# EasyEDA Pro project ProPrj_fpga-expansion-board-v2_2026-01-11.epro

# Schematic Schematic1
Board Name: Board1; Create Date: 2026-01-07; Page Name: SCHEMATIC; Project Name: fpga-expansion-board-v2; Schematic Name: Schematic1; Update Date: 2026-01-11; Company: EasyEDA.com; Page Size: A4; Version: V1.0
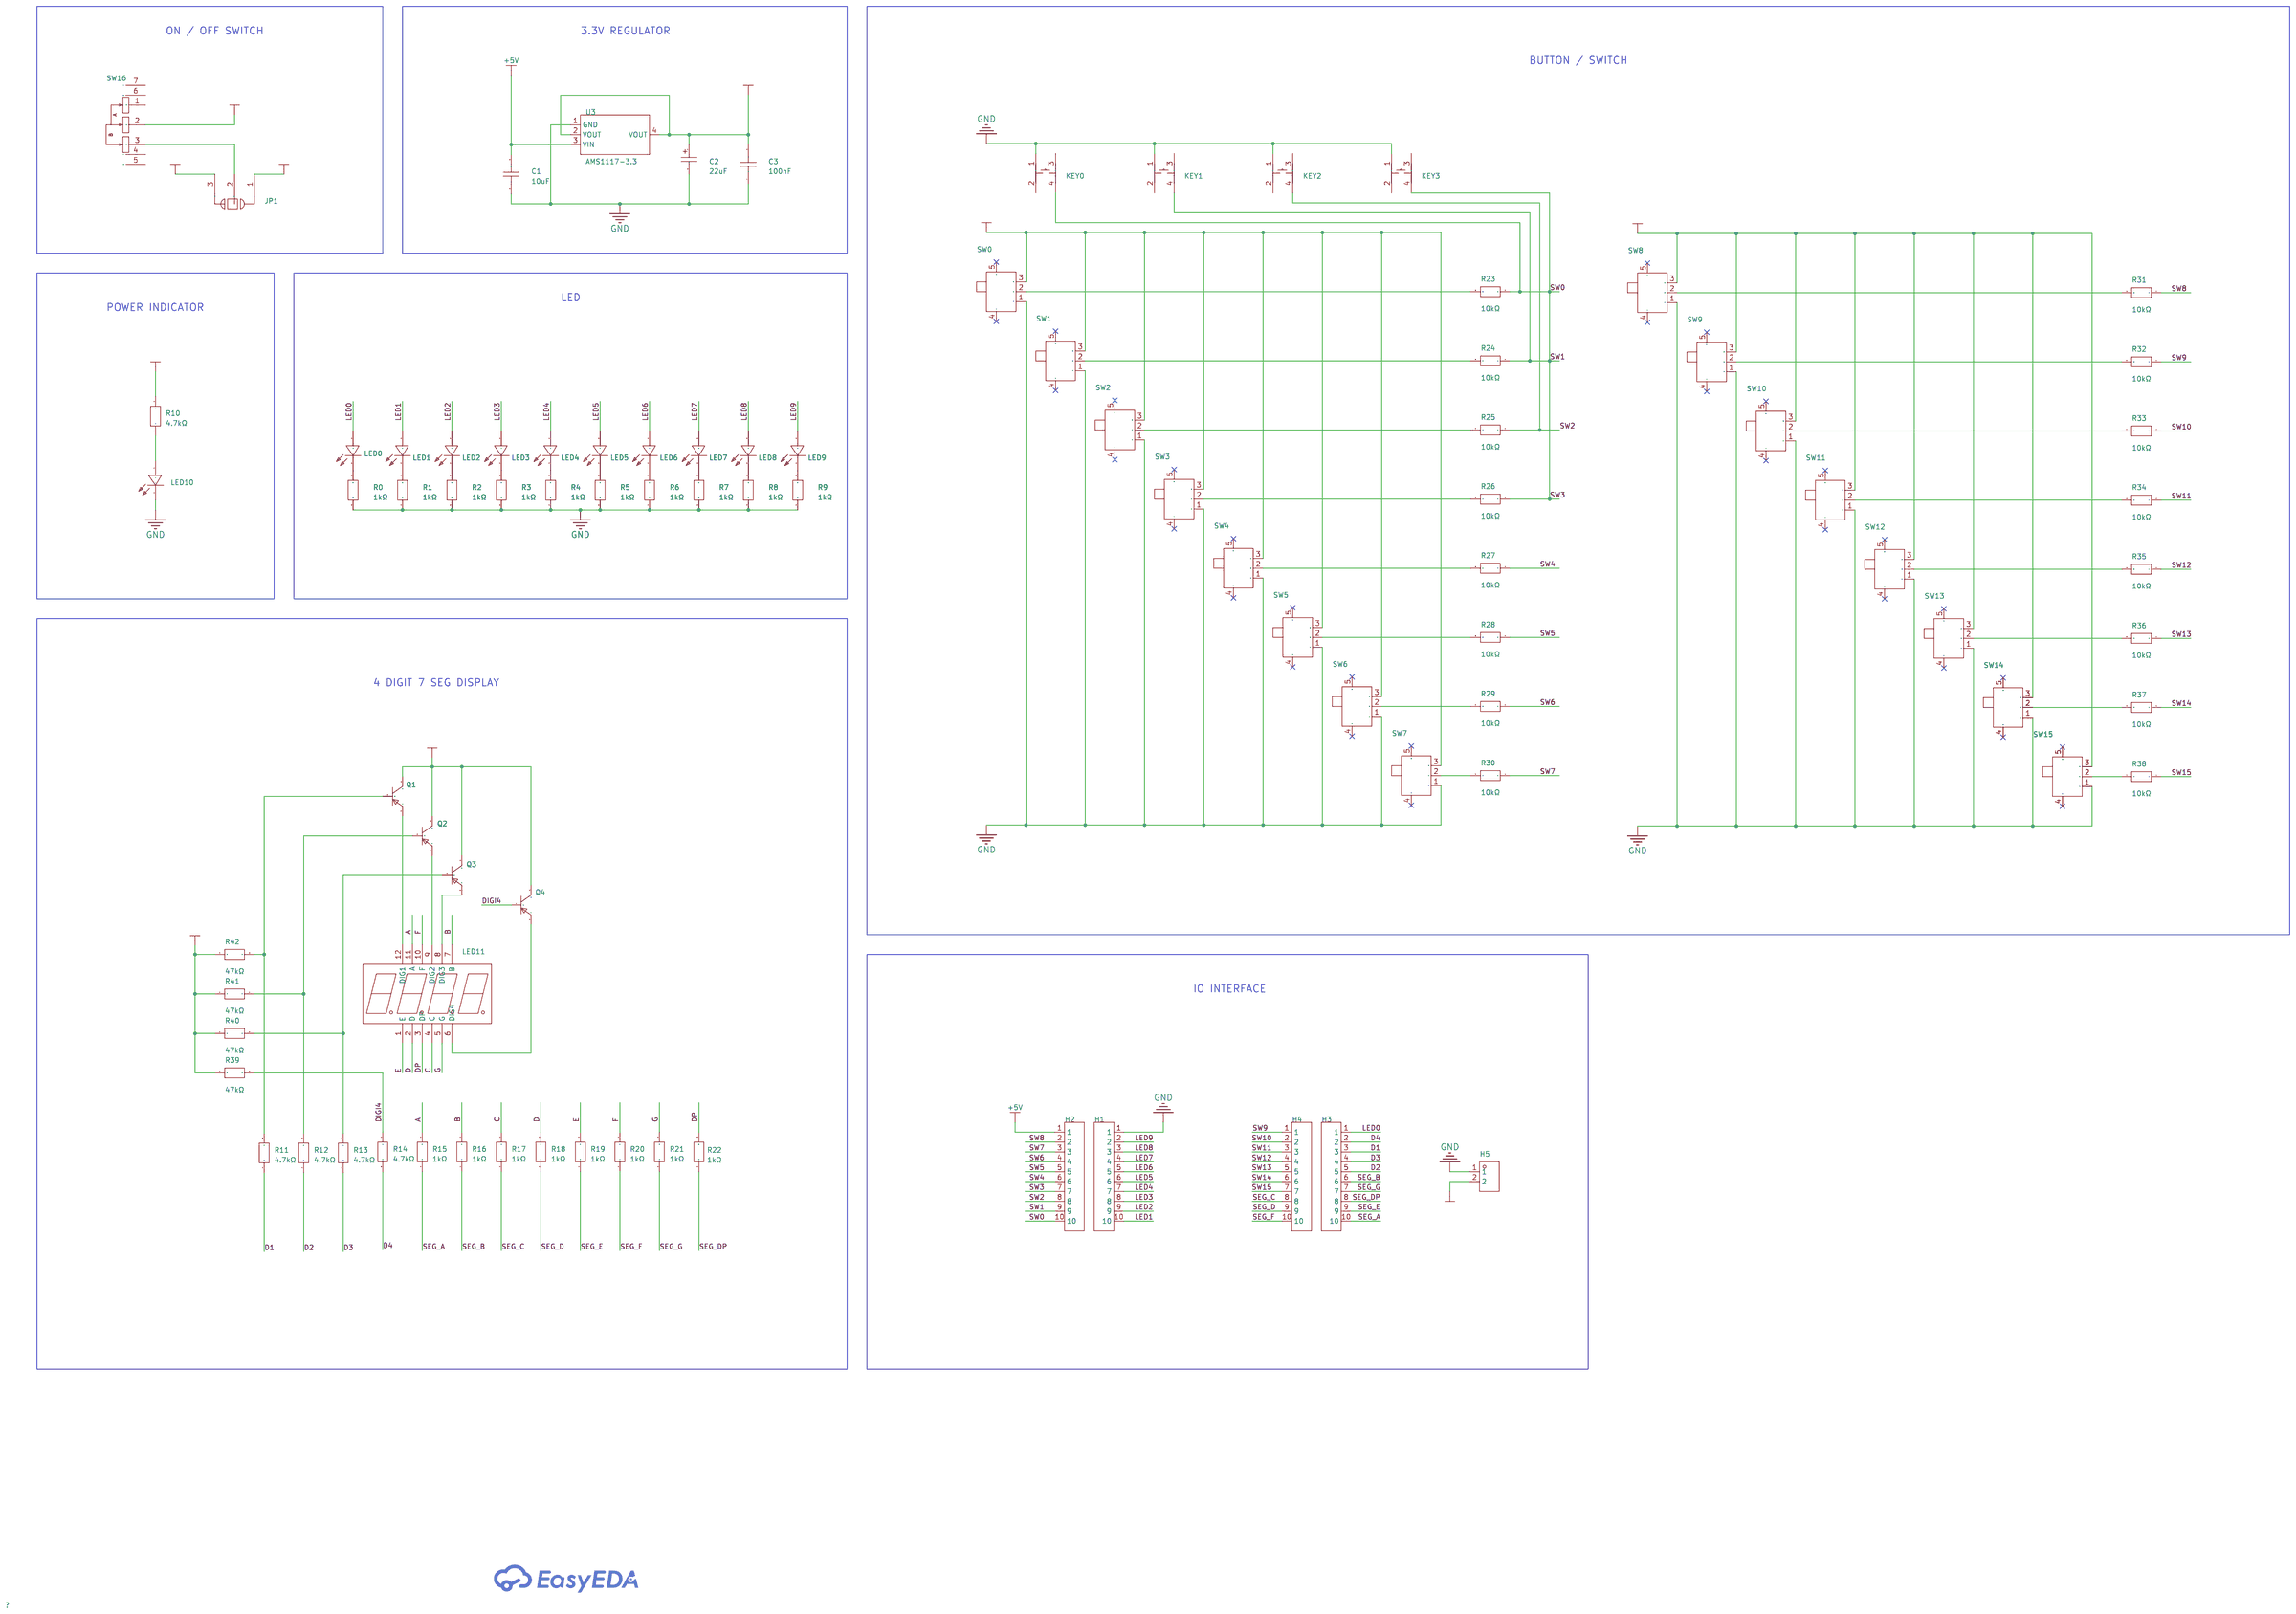
[diagram p0: schematic sheet]

## Parts
C1  10uF  [C0805]
C2  22uF  [CASE-B_3528]
C3  100nF  [C0603]
H1  5AML4-11560-110-W0  [HDR-TH_10P-P2.54-V-M-1]
H2  5AML4-11560-110-W0  [HDR-TH_10P-P2.54-V-M-1]
H3  5AML4-11560-110-W0  [HDR-TH_10P-P2.54-V-M-1]
H4  5AML4-11560-110-W0  [HDR-TH_10P-P2.54-V-M-1]
H5  FG-PZ2.54-01-02P  [HDR-TH_2P-P2.54-V-M]
JP1  Jumper:SolderJumper-3_P1.3mm_Open_RoundedPad1.0x1.5mm  [Jumper:SolderJumper-3_P1.3mm_Open_RoundedPad1.0x1.5mm]
KEY0  KH-6X6X6H-SMT-FS-D  [SW-SMD_4P-L6.0-W6.0-P4.50-LS9.5]
KEY1  KH-6X6X6H-SMT-FS-D  [SW-SMD_4P-L6.0-W6.0-P4.50-LS9.5]
KEY2  KH-6X6X6H-SMT-FS-D  [SW-SMD_4P-L6.0-W6.0-P4.50-LS9.5]
KEY3  KH-6X6X6H-SMT-FS-D  [SW-SMD_4P-L6.0-W6.0-P4.50-LS9.5]
LED0  NCD0805R1  [LED0805-R-RD]
LED1  NCD0805R1  [LED0805-R-RD]
LED2  NCD0805R1  [LED0805-R-RD]
LED3  NCD0805R1  [LED0805-R-RD]
LED4  NCD0805R1  [LED0805-R-RD]
LED5  NCD0805R1  [LED0805-R-RD]
LED6  NCD0805R1  [LED0805-R-RD]
LED7  NCD0805R1  [LED0805-R-RD]
LED8  NCD0805R1  [LED0805-R-RD]
LED9  NCD0805R1  [LED0805-R-RD]
LED10  NCD0805R1  [LED0805-R-RD]
LED11  SR410361N  [LED-SEG-TH_12P-L30.0-W14.0-P2.54-S10.26-BL]
Q1  SS8550  [SOT-23-3_L2.9-W1.4-P1.90-LS2.6-BR]
Q2  SS8550  [SOT-23-3_L2.9-W1.4-P1.90-LS2.6-BR]
Q3  SS8550  [SOT-23-3_L2.9-W1.4-P1.90-LS2.6-BR]
Q4  SS8550  [SOT-23-3_L2.9-W1.4-P1.90-LS2.6-BR]
R0  1kΩ  [R0805]
R1  1kΩ  [R0805]
R2  1kΩ  [R0805]
R3  1kΩ  [R0805]
R4  1kΩ  [R0805]
R5  1kΩ  [R0805]
R6  1kΩ  [R0805]
R7  1kΩ  [R0805]
R8  1kΩ  [R0805]
R9  1kΩ  [R0805]
R10  4.7kΩ  [R0805]
R11  4.7kΩ  [R0805]
R12  4.7kΩ  [R0805]
R13  4.7kΩ  [R0805]
R14  4.7kΩ  [R0805]
R15  1kΩ  [R0805]
R16  1kΩ  [R0805]
R17  1kΩ  [R0805]
R18  1kΩ  [R0805]
R19  1kΩ  [R0805]
R20  1kΩ  [R0805]
R21  1kΩ  [R0805]
R22  1kΩ  [R0805]
R23  10kΩ  [R0805]
R24  10kΩ  [R0805]
R25  10kΩ  [R0805]
R26  10kΩ  [R0805]
R27  10kΩ  [R0805]
R28  10kΩ  [R0805]
R29  10kΩ  [R0805]
R30  10kΩ  [R0805]
R31  10kΩ  [R0805]
R32  10kΩ  [R0805]
R33  10kΩ  [R0805]
R34  10kΩ  [R0805]
R35  10kΩ  [R0805]
R36  10kΩ  [R0805]
R37  10kΩ  [R0805]
R38  10kΩ  [R0805]
R39  47kΩ  [R0805]
R40  47kΩ  [R0805]
R41  47kΩ  [R0805]
R42  47kΩ  [R0805]
SW0  SS12F44G4  [SW-TH_SHOU-HAN_SS12F44G4]
SW1  SS12F44G4  [SW-TH_SHOU-HAN_SS12F44G4]
SW2  SS12F44G4  [SW-TH_SHOU-HAN_SS12F44G4]
SW3  SS12F44G4  [SW-TH_SHOU-HAN_SS12F44G4]
SW4  SS12F44G4  [SW-TH_SHOU-HAN_SS12F44G4]
SW5  SS12F44G4  [SW-TH_SHOU-HAN_SS12F44G4]
SW6  SS12F44G4  [SW-TH_SHOU-HAN_SS12F44G4]
SW7  SS12F44G4  [SW-TH_SHOU-HAN_SS12F44G4]
SW8  SS12F44G4  [SW-TH_SHOU-HAN_SS12F44G4]
SW9  SS12F44G4  [SW-TH_SHOU-HAN_SS12F44G4]
SW10  SS12F44G4  [SW-TH_SHOU-HAN_SS12F44G4]
SW11  SS12F44G4  [SW-TH_SHOU-HAN_SS12F44G4]
SW12  SS12F44G4  [SW-TH_SHOU-HAN_SS12F44G4]
SW13  SS12F44G4  [SW-TH_SHOU-HAN_SS12F44G4]
SW14  SS12F44G4  [SW-TH_SHOU-HAN_SS12F44G4]
SW15  SS12F44G4  [SW-TH_SHOU-HAN_SS12F44G4]
SW16  MK-12C02-G015  [SW-SMD_G-SWITCH_MK-12C02-G015]
U3  AMS1117-3.3  [SOT-223-3_L6.5-W3.4-P2.30-LS7.0-BR]

## Library data of the parts
C1 = GRM21BR61H106KE43L: Capacitance:10uF Tolerance:±10% Tolerance:±10% Voltage Rating:50V Temperature Coefficient:X5R; LCSC Part Name: 10uF ±10% 50V; Supplier Part: C440198; Manufacturer: muRata(村田); Supplier Footprint: 0805; JLCPCB Part Class: Basic Part; Datasheet: https://item.szlcsc.com/datasheet/GRM21BR61H106KE43L/439567.html; Supplier: LCSC; Tolerance: ±10%; Voltage Rating: 50V; Temperature Coefficient: X5R
C2 = TAJB226K016RNJ: Capacitance:22uF Tolerance:±10% Tolerance:±10% Voltage Rating:16V Equivalent Series Resistance(ESR):2.3Ω@100kHz Operating Temperature:-55℃~+125℃ Operating Temperature:-55℃~+125℃; LCSC Part Name: 22uF ±10% 16V; Supplier Part: C8020; Manufacturer: Kyocera AVX; Supplier Footprint: CASE-B-3528-21(mm); JLCPCB Part Class: Extended Part; Supplier: LCSC; Tolerance: ±10%; Voltage Rating: 16V; Equivalent Series Resistance(ESR): 2.3Ω@100kHz; Operating Temperature: -55℃~+125℃
C3 = CC0603KRX7R9BB104: Capacitance:100nF Tolerance:±10% Tolerance:±10% Voltage Rating:50V Temperature Coefficient:X7R; LCSC Part Name: 100nF ±10% 50V; Supplier Part: C14663; Manufacturer: YAGEO(国巨); Supplier Footprint: 0603; JLCPCB Part Class: Basic Part; Datasheet: https://atta.szlcsc.com/upload/public/pdf/source/20180910/C282072_33301C7F631E79921B82A8DAC6BCC5B3.pdf; Supplier: LCSC; Tolerance: ±10%; Voltage Rating: 50V; Temperature Coefficient: X7R
H1-H4 = 5AML4-11560-110-W0: Pin Structure:1x10P Pitch:2.54mm Row Spacing:- Circluar Pins/Square Pins:Pin Header Mounting Type:Through Hole Number of Rows:1 Number of Pins:10P Current Rating:3A Voltage Rating (Max):- Length of Mating Pin:6mm Insulation Height:2.5mm Length of End Conn; LCSC Part Name: 1x10P 间距:2.54mm 方针 直插; Supplier Part: C41374240; Manufacturer: SAMZO(三佐); Supplier Footprint: 插件,P=2.54mm; Datasheet: https://atta.szlcsc.com/upload/public/pdf/source/20240717/E6C59586925ABF058B406B6757A67FC7.pdf; Supplier: LCSC; Pin Structure: 1x10P; Pitch: 2.54mm; Circluar Pins/Square Pins: Pin Header; Mounting Type: Through Hole; Number of Rows: 1; Number of Pins: 10P; Current Rating: 3A; Length of Mating Pin: 6mm; Insulation Height: 2.5mm; Length of End Connection Pin: 3mm; Contact Material: Brass; Contact Plating: Gold; Operating Temperature: -40℃~+105℃; Color: Black
H5 = FG-PZ2.54-01-02P: Pin Structure:1x2P Pitch:2.54mm Circluar Pins/Square Pins:Pin Header Mounting Type:Through Hole Number of Rows:1 Number of Pins:2P Current Rating:3A Length of Mating Pin:6mm Insulation Height:2.5mm Length of End Connection Pin:3mm Contact Plating:Gold Col; LCSC Part Name: 1x2P 间距:2.54mm 方针 直插; Supplier Part: C42391436; Manufacturer: FG(富港); Supplier Footprint: 插件,P=2.54mm; JLCPCB Part Class: Extended Part; Datasheet: https://item.szlcsc.com/datasheet/FG-PZ2.54-01-02P/44326031.html; Supplier: LCSC; Pin Structure: 1x2P; Pitch: 2.54mm; Circluar Pins/Square Pins: Pin Header; Mounting Type: Through Hole; Number of Rows: 1; Number of Pins: 2P; Current Rating: 3A; Length of Mating Pin: 6mm; Insulation Height: 2.5mm; Length of End Connection Pin: 3mm; Contact Plating: Gold; Color: Black
JP1 = Jumper:SolderJumper-3_P1.3mm_Open_RoundedPad1.0x1.5mm
KEY0-KEY3 = KH-6X6X6H-SMT-FS-D: Length:6mm Width:6mm Switch Height:6mm; LCSC Part Name: 轻触开关6*6*6H防水贴片 袋装; Supplier Part: C18186510; Manufacturer: kinghelm(金航标); Supplier Footprint: SMD-4P,6x6mm; JLCPCB Part Class: Extended Part; Datasheet: https://item.szlcsc.com/datasheet/KH-6X6X6H-SMT-FS-D/19335377.html; Supplier: LCSC; Length: 6mm; Width: 6mm; Switch Height: 6mm
LED0-LED10 = NCD0805R1_C84256: Lamp Holder Type:- Emitted Color:Red Forward Voltage (VF):1.6V~2.6V Forward Voltage (VF):1.6V~2.6V Power Dissipation:65mW Forward Current:20mA Dominant Wavelength:615nm~630nm Dominant Wavelength:615nm~630nm Peak Wavelength:- Diode Configuration:独立二极管 Lens; Supplier Part: C84256; Manufacturer: 国星光电; Supplier Footprint: 0805; JLCPCB Part Class: Basic Part; Datasheet: https://atta.szlcsc.com/upload/public/pdf/source/20200820/C84256_F0A75A43B3EAD75808600A0514C76B99.pdf; Supplier: LCSC; Emitted Color: Red; Forward Voltage (VF): 1.6V~2.6V; Power Dissipation: 65mW; Forward Current: 20mA; Dominant Wavelength: 615nm~630nm; Diode Configuration: 独立二极管; Lens Color: 无色透明透镜; Luminous Intensity: 67mcd~195mcd; Viewing Angle: 130°; Operating Temperature: -30℃~+85℃
LED11 = SR410361N: Number of Characters:4Bit Luminous Color:Red LED Polarity:共阳极 Digit/Alpha Size(inch):0.36; LCSC Part Name: 4位0.36英寸红色数码管 共阳极; Supplier Part: C132660; Manufacturer: ARKLED(方舟); Supplier Footprint: 插件; JLCPCB Part Class: Extended Part; Datasheet: https://atta.szlcsc.com/upload/public/pdf/source/20171014/C132660_15079754140001038126.pdf; Supplier: LCSC; Number of Characters: 4Bit; Luminous Color: Red; LED Polarity: 共阳极; Digit/Alpha Size(inch): 0.36
Q1-Q4 = SS8550_C727138: type:PNP Current - Collector(Ic):1.5A Collector - Emitter Voltage VCEO:25V Pd - Power Dissipation:300mW DC Current Gain:200@100mA,1V DC Current Gain:200@100mA,1V Transition frequency(fT):100MHz Current - Collector Cutoff:100nA Vce Saturation(VCE(sat)):500; LCSC Part Name: hfe=120~200 PNP 电流:1.5A 电压:25V; Supplier Part: C727138; Manufacturer: TWGMC(迪嘉); Supplier Footprint: SOT-23; JLCPCB Part Class: Extended Part; Datasheet: https://item.szlcsc.com/datasheet/SS8550/774243.html; Supplier: LCSC; type: PNP; Current - Collector(Ic): 1.5A; Collector - Emitter Voltage VCEO: 25V; Pd - Power Dissipation: 300mW; DC Current Gain: 200@100mA,1V; Transition frequency(fT): 100MHz; Current - Collector Cutoff: 100nA; Vce Saturation(VCE(sat)): 500mV; Operating Temperature: -55℃~+150℃
R0-R9 R15-R22 = 0805W8F1001T5E: Type:Thick Film Resistors Resistance:1kΩ Tolerance:±1% Tolerance:±1% Power(Watts): Overload Voltage (Max): Temperature Coefficient:±100ppm/℃ Temperature Coefficient:±100ppm/℃ Operating Temperature Range:-55℃~+155℃ Operating Temperature Range:-55℃~+155℃; LCSC Part Name: 1kΩ ±1% 125mW 厚膜电阻; Supplier Part: C17513; Manufacturer: UNI-ROYAL(厚声); Supplier Footprint: 0805; JLCPCB Part Class: Basic Part; Datasheet: https://atta.szlcsc.com/upload/public/pdf/source/20200306/C422600_1E6D84923E4A46A82E41ADD87F860B5C.pdf; Supplier: LCSC; Type: Thick Film Resistors; Tolerance: ±1%; Temperature Coefficient: ±100ppm/℃; Operating Temperature Range: -55℃~+155℃
R10-R14 R39-R42 = 0805W8F4701T5E: Type:Thick Film Resistors Resistance:4.7kΩ Tolerance:±1% Tolerance:±1% Power(Watts): Overload Voltage (Max): Temperature Coefficient:±100ppm/℃ Temperature Coefficient:±100ppm/℃ Operating Temperature Range:-55℃~+155℃ Operating Temperature Range:-55℃~+155℃; LCSC Part Name: 4.7kΩ ±1% 125mW 厚膜电阻; Supplier Part: C17673; Manufacturer: UNI-ROYAL(厚声); Supplier Footprint: 0805; JLCPCB Part Class: Basic Part; Datasheet: https://atta.szlcsc.com/upload/public/pdf/source/20200306/C422600_1E6D84923E4A46A82E41ADD87F860B5C.pdf; Supplier: LCSC; Type: Thick Film Resistors; Tolerance: ±1%; Temperature Coefficient: ±100ppm/℃; Operating Temperature Range: -55℃~+155℃
R23-R38 = 0805W8F1002T5E: Type:Thick Film Resistor Resistance:10kΩ Tolerance:±1% Tolerance:±1% Power(Watts):125mW Voltage-Supply(Max):150V Temperature Coefficient:±100ppm/℃ Temperature Coefficient:±100ppm/℃ Operating Temperature:-55℃~+155℃ Operating Temperature:-55℃~+155℃; LCSC Part Name: 10kΩ ±1% 125mW 厚膜电阻; Supplier Part: C17414; Manufacturer: UNI-ROYAL(厚声); Supplier Footprint: 0805; JLCPCB Part Class: Basic Part; Datasheet: https://item.szlcsc.com/datasheet/0805W8F1002T5E/18102.html; Supplier: LCSC; Type: Thick Film Resistor; Tolerance: ±1%; Power(Watts): 125mW; Voltage-Supply(Max): 150V; Temperature Coefficient: ±100ppm/℃; Operating Temperature: -55℃~+155℃
SW0-SW15 = SS12F44G4: Circuit:SPDT Actuator Style:- Termination Style:PC Pin Length:12mm Width:4.5mm Switch Height:6mm Mounting Type:Through Hole Actuator Color:- Current Rating:300mA Voltage Rating:50V Life:5,000 cycles Operating Temperature:-10℃~+50℃ Operating Temperature:-1; Supplier Part: C2887261; Manufacturer: SHOU HAN(首韩); Supplier Footprint: 插件,12x4.5mm; JLCPCB Part Class: Extended Part; Datasheet: https://item.szlcsc.com/datasheet/SS12F44G4/3103829.html; Supplier: LCSC; Circuit: SPDT; Termination Style: PC Pin; Length: 12mm; Width: 4.5mm; Switch Height: 6mm; Mounting Type: Through Hole; Current Rating: 300mA; Voltage Rating: 50V; Life: 5,000 cycles; Operating Temperature: -10℃~+50℃
SW16 = MK-12C02-G015_C2911519: Circuit:SPDT Actuator Style:Rectangular Columnar Termination Style:- Length:6.6mm Width:1.4mm Switch Height:4.2mm Mounting Type:Surface Mount, Right Angle Actuator Color:Black Current Rating:1A Voltage Rating:6V Life:10,000 Cycles Operating Temperature:-2; LCSC Part Name: 七脚贴片微型拨动开关 G1.5; Supplier Part: C2911519; Manufacturer: G-Switch(品赞); Supplier Footprint: SMD,6.6x1.4mm; JLCPCB Part Class: Extended Part; Datasheet: https://item.szlcsc.com/datasheet/MK-12C02-G015/3191561.html; Supplier: LCSC; Circuit: SPDT; Actuator Style: Rectangular Columnar; Length: 6.6mm; Width: 1.4mm; Switch Height: 4.2mm; Mounting Type: Surface Mount, Right Angle; Actuator Color: Black; Current Rating: 1A; Voltage Rating: 6V; Life: 10,000 Cycles; Operating Temperature: -20℃~+70℃
U3 = AMS1117-3.3_C6186: Output Type:Fixed Voltage - Supply:16V Output Voltage:3.3V Output Voltage:3.3V Output Current:1A Power Supply Rejection Ratio (PSRR):72dB@(120Hz) Voltage Dropout:1.1V@(800mA) standby current:5mA Noise:0.003%Vout Features:Over Current Protection；Over Tempe; LCSC Part Name: 输出3.3V 1A; Supplier Part: C6186; Manufacturer: AMS; Supplier Footprint: SOT-223; JLCPCB Part Class: Basic Part; Datasheet: https://item.szlcsc.com/datasheet/AMS1117-3.3/6652.html; Supplier: LCSC; Output Type: Fixed; Voltage - Supply: 16V; Output Voltage: 3.3V; Output Current: 1A; Power Supply Rejection Ratio (PSRR): 72dB@(120Hz); Voltage Dropout: 1.1V@(800mA); standby current: 5mA; Noise: 0.003%Vout; Features: Over Current Protection；Over Temperature Protection; Operating Temperature: -40℃~+125℃; Output Configuration: Positive; Number of Outputs: 1

## Nets
3.3V: Q1.3(C) Q2.3(C) Q3.3(C) Q4.3(C) R39.1 R40.1 R41.1 R42.1 SW0.3 SW1.3 SW2.3 SW3.3 SW4.3 SW5.3 SW6.3 SW7.3 SW8.3 SW9.3 SW10.3 SW11.3 SW12.3 SW13.3 SW14.3 SW15.3 SW16.2
3.3V_F: H5.2 JP1.1
3.3V_R: C2.1 C3.2 JP1.3 R10.2 U3.2(VOUT) U3.4(VOUT)
+5V: C1.2 H2.1 U3.3(VIN)
GND: C1.1 C2.2 C3.1 H1.1 H5.1 KEY0.1(A) KEY1.1(A) KEY2.1(A) KEY3.1(A) LED10.2(-) R0.1 R1.1 R2.1 R3.1 R4.1 R5.1 R6.1 R7.1 R8.1 R9.1 SW0.1 SW1.1 SW2.1 SW3.1 SW4.1 SW5.1 SW6.1 SW7.1 SW8.1 SW9.1 SW10.1 SW11.1 SW12.1 SW13.1 SW14.1 SW15.1 U3.1(GND)
A: LED11.11(A) R15.2
B: LED11.7(B) R16.2
C: LED11.4(C) R17.2
D: LED11.2(D) R18.2
D1: H3.3 R11.1
D2: H3.5 R12.1
D3: H3.4 R13.2
D4: H3.2 R14.2
DIGI4: Q4.1(B) R14.1 R39.2
DP: LED11.3(DP) R22.2
E: LED11.1(E) R19.2
F: LED11.10(F) R20.2
G: LED11.5(G) R21.2
LED0: H3.1 LED0.1(+)
LED1: H1.10 LED1.1(+)
LED2: H1.9 LED2.1(+)
LED3: H1.8 LED3.1(+)
LED4: H1.7 LED4.1(+)
LED5: H1.6 LED5.1(+)
LED6: H1.5 LED6.1(+)
LED7: H1.4 LED7.1(+)
LED8: H1.3 LED8.1(+)
LED9: H1.2 LED9.1(+)
SEG_A: H3.10 R15.1
SEG_B: H3.6 R16.1
SEG_C: H4.8 R17.1
SEG_D: H4.9 R18.1
SEG_DP: H3.8 R22.1
SEG_E: H3.9 R19.1
SEG_F: H4.10 R20.1
SEG_G: H3.7 R21.1
SW0: H2.10 KEY0.4(D) R23.1
SW1: H2.9 KEY1.4(D) R24.1
SW2: H2.8 KEY2.4(D) R25.1
SW3: H2.7 KEY3.4(D) R26.1
SW4: H2.6 R27.1
SW5: H2.5 R28.1
SW6: H2.4 R29.1
SW7: H2.3 R30.1
SW8: H2.2 R31.1
SW9: H4.1 R32.1
SW10: H4.2 R33.1
SW11: H4.3 R34.1
SW12: H4.4 R35.1
SW13: H4.5 R36.1
SW14: H4.6 R37.1
SW15: H4.7 R38.1
$2N1941: LED10.1(+) R10.1
$2N2644: LED11.6(DIG4) Q4.2(E)
$2N2657: Q1.1(B) R11.2 R42.2
$2N2658: Q2.1(B) R12.2 R41.2
$2N2659: Q3.1(B) R13.1 R40.2
$2N2685: LED11.8(DIG3) Q3.2(E)
$2N2688: LED11.9(DIG2) Q2.2(E)
$2N2689: LED11.12(DIG1) Q1.2(E)
$2N3631: LED0.2(-) R0.2
$2N3633: LED1.2(-) R1.2
$2N3635: LED2.2(-) R2.2
$2N3638: LED4.2(-) R4.2
$2N3640: LED3.2(-) R3.2
$2N3642: LED5.2(-) R5.2
$2N3644: LED6.2(-) R6.2
$2N3646: LED7.2(-) R7.2
$2N3648: LED8.2(-) R8.2
$2N3652: LED9.2(-) R9.2
$2N6552: JP1.2 SW16.3
$2N13851: R30.2 SW7.2
$2N13869: R29.2 SW6.2
$2N13870: R28.2 SW5.2
$2N13871: R27.2 SW4.2
$2N13872: R26.2 SW3.2
$2N13873: R25.2 SW2.2
$2N13874: R24.2 SW1.2
$2N13876: R38.2 SW15.2
$2N13894: R37.2 SW14.2
$2N13895: R36.2 SW13.2
$2N13896: R35.2 SW12.2
$2N13897: R34.2 SW11.2
$2N13898: R33.2 SW10.2
$2N13899: R32.2 SW9.2
$2N13900: R31.2 SW8.2
$2N13901: R23.2 SW0.2

Not connected (* = marked no-connect by the designer): KEY0 2(B) 3(C); KEY1 2(B) 3(C); KEY2 2(B) 3(C); KEY3 2(B) 3(C); SW0 4* 5*; SW1 4* 5*; SW2 4* 5*; SW3 4* 5*; SW4 4* 5*; SW5 4* 5*; SW6 4* 5*; SW7 4* 5*; SW8 4* 5*; SW9 4* 5*; SW10 4* 5*; SW11 4* 5*; SW12 4* 5*; SW13 4* 5*; SW14 4* 5*; SW15 4* 5*; SW16 1 4 5 6 7

## Notes on the sheet
- ON / OFF SWITCH
- 3.3V REGULATOR
- BUTTON / SWITCH
- LED
- POWER INDICATOR
- 4 DIGIT 7 SEG DISPLAY
- IO INTERFACE

# Board PCB1
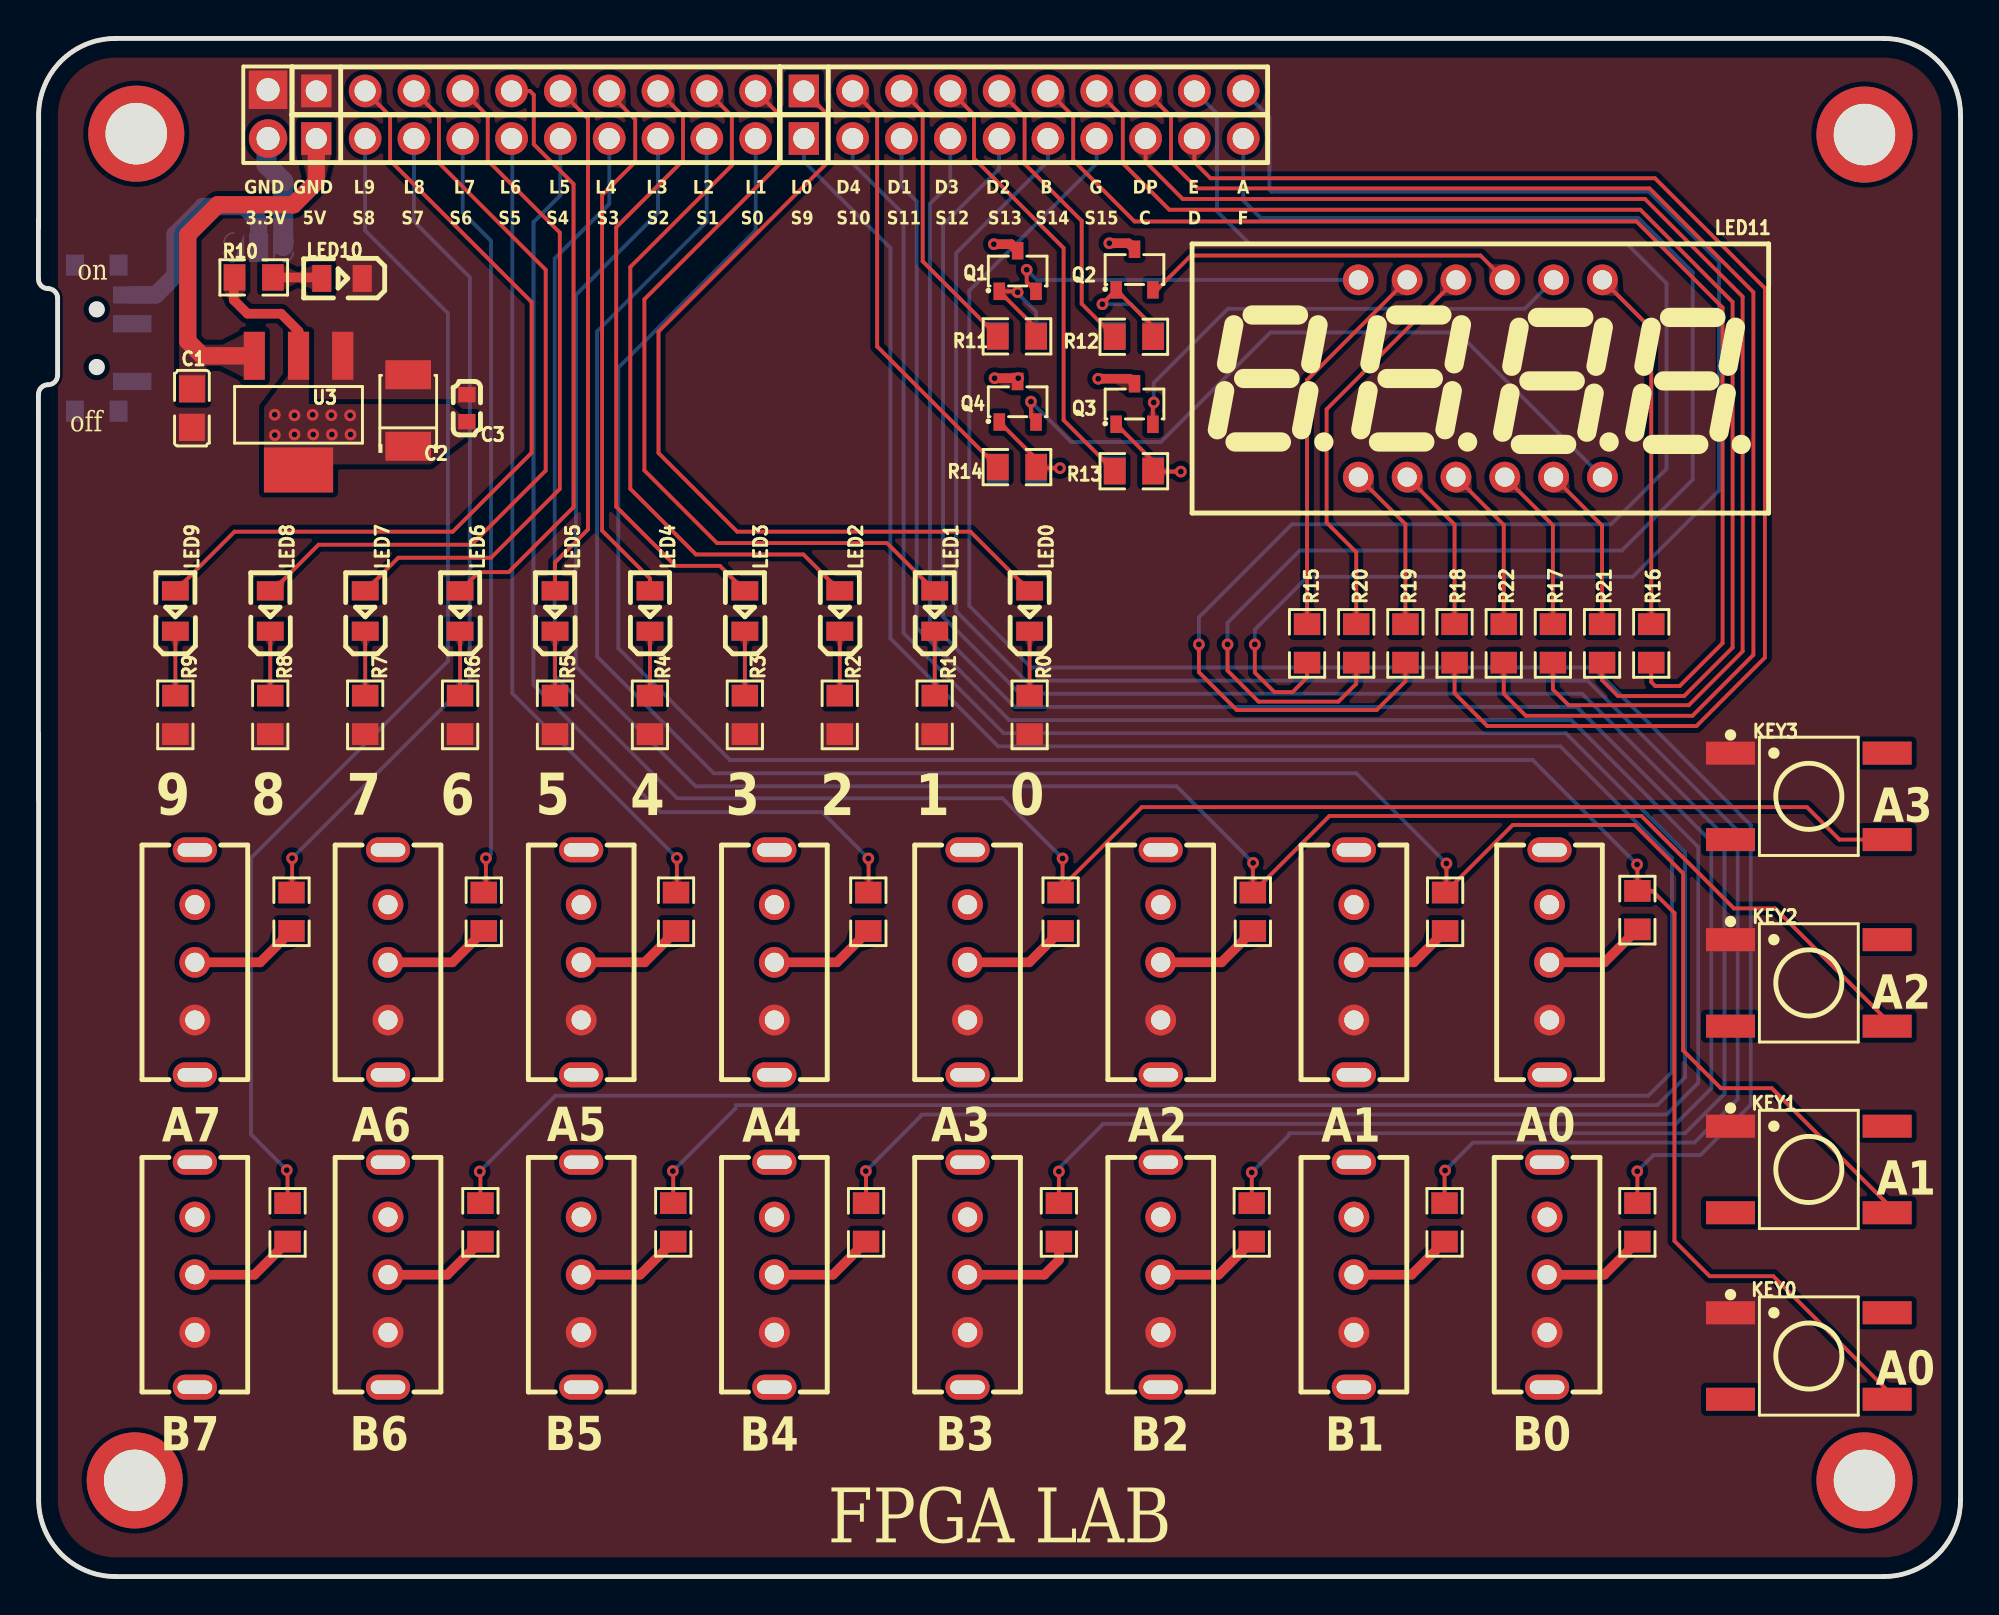
[diagram p1: board, top side]
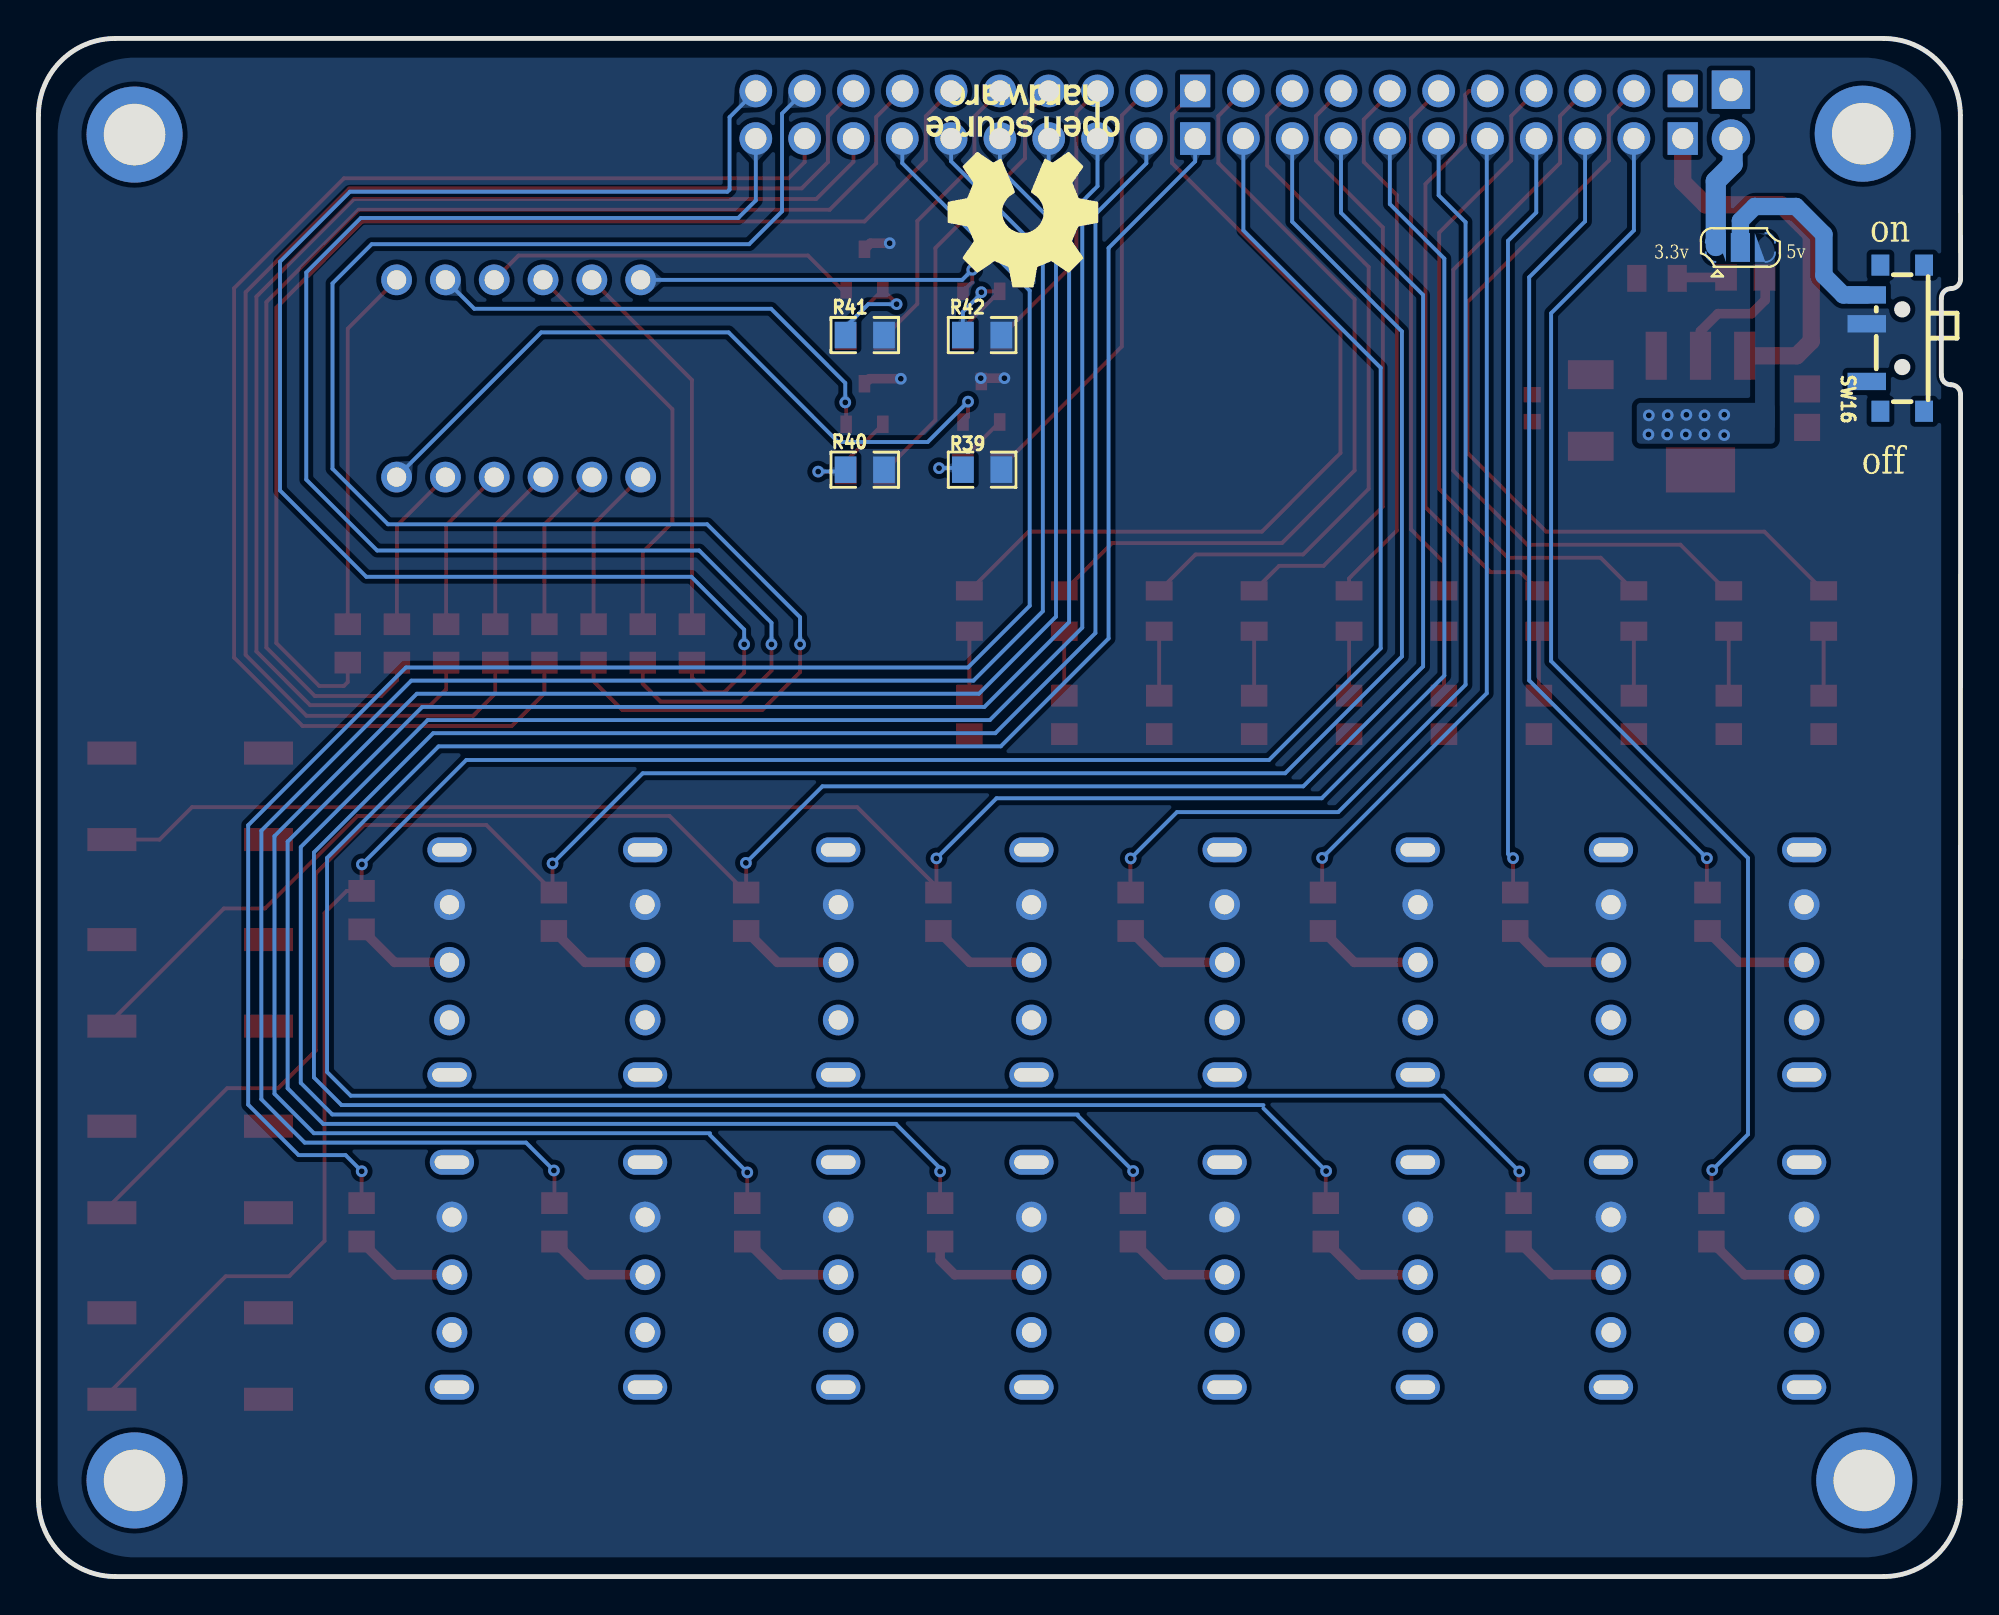
[diagram p2: board, bottom side, seen from below]

Outline 100.01 x 80 mm; copper layers: Top Layer, Bottom Layer. Coordinates in mm from the lower left corner of the outline.
Outline path: 0,67.49 0.01,76 arc(1.18,78.83) 4.01,80 96.01,80 arc(98.84,78.83) 100.01,76 100.01,4 arc(98.84,1.17) 96.01,0 4.01,0 arc(1.18,1.17) 0.01,4 0,61.49 arc(0.15,61.84) 0.5,61.99 arc(0.85,62.14) 1,62.49 1,66.49 arc(0.85,66.84) 0.5,66.99 arc(0.15,67.14) 0,67.49
Stack: Top Layer 0.035mm / Dielectric1 1.51mm FR4 er 4.5 / Bottom Layer 0.035mm

## Design rules (mm)
template: Custom Config
spacing copperThickness1oz (default): track to track 0.102, other pairs 0.152 to 0.3
spacing copperThickness2oz: track to track 0.203, other pairs 0.152 to 0.3
track width copperThickness1oz (default): min 0.2, default 0.5, max 2.54
track width copperThickness2oz: min 0.203, default 0.254, max 2.54
differential pair differentialPair (default): width min 0.127, default 0.254, max 2.54; gap min 0.152, default 0.152
via viaSize (default): diameter min 0.5, default 0.61, max 10; hole min 0.3, default 0.305, max 6.3

## Placement (name value [footprint] x y rotation side)
C1  10uF  [C0805]  7.99 60.77 90 top
C2  22uF  [CASE-B_3528]  19.24 60.65 90 top
C3  100nF  [C0603]  22.29 60.77 270 top
H1  5AML4-11560-110-W0  [HDR-TH_10P-P2.54-V-M-1]  25.89 77.27 0 top
H2  5AML4-11560-110-W0  [HDR-TH_10P-P2.54-V-M-1]  25.89 74.79 0 top
H3  5AML4-11560-110-W0  [HDR-TH_10P-P2.54-V-M-1]  51.25 77.27 0 top
H4  5AML4-11560-110-W0  [HDR-TH_10P-P2.54-V-M-1]  51.25 74.79 0 top
H5  FG-PZ2.54-01-02P  [HDR-TH_2P-P2.54-V-M]  11.95 76.06 270 top
JP1  -  [Jumper:SolderJumper-3_P1.3mm_Open_RoundedPad1.0x1.5mm]  11.45 69.13 180 bottom
KEY0  KH-6X6X6H-SMT-FS-D  [SW-SMD_4P-L6.0-W6.0-P4.50-LS9.5]  92.11 11.47 0 top
KEY1  KH-6X6X6H-SMT-FS-D  [SW-SMD_4P-L6.0-W6.0-P4.50-LS9.5]  92.11 21.17 0 top
KEY2  KH-6X6X6H-SMT-FS-D  [SW-SMD_4P-L6.0-W6.0-P4.50-LS9.5]  92.11 30.88 0 top
KEY3  KH-6X6X6H-SMT-FS-D  [SW-SMD_4P-L6.0-W6.0-P4.50-LS9.5]  92.11 40.58 0 top
LED0  NCD0805R1  [LED0805-R-RD]  51.57 50.22 90 top
LED1  NCD0805R1  [LED0805-R-RD]  46.63 50.22 90 top
LED2  NCD0805R1  [LED0805-R-RD]  41.7 50.22 90 top
LED3  NCD0805R1  [LED0805-R-RD]  36.76 50.22 90 top
LED4  NCD0805R1  [LED0805-R-RD]  31.82 50.22 90 top
LED5  NCD0805R1  [LED0805-R-RD]  26.88 50.22 90 top
LED6  NCD0805R1  [LED0805-R-RD]  21.94 50.22 90 top
LED7  NCD0805R1  [LED0805-R-RD]  17 50.22 90 top
LED8  NCD0805R1  [LED0805-R-RD]  12.06 50.22 90 top
LED9  NCD0805R1  [LED0805-R-RD]  7.12 50.22 90 top
LED10  NCD0805R1  [LED0805-R-RD]  15.79 67.52 180 top
LED11  SR410361N  [LED-SEG-TH_12P-L30.0-W14.0-P2.54-S10.26-BL]  75.02 62.31 0 top
NOREF  -  [Pad_e133]  95.01 5 0 top
NOREF#2  -  [Pad_e132]  95.01 75 0 top
NOREF#3  -  [Pad_e134]  5.01 5 0 top
NOREF#4  -  [Pad_e130]  5.09 75.05 0 top
Q1  SS8550  [SOT-23-3_L2.9-W1.4-P1.90-LS2.6-BR]  50.95 67.9 270 top
Q2  SS8550  [SOT-23-3_L2.9-W1.4-P1.90-LS2.6-BR]  57.03 67.98 270 top
Q3  SS8550  [SOT-23-3_L2.9-W1.4-P1.90-LS2.6-BR]  57.03 60.99 270 top
Q4  SS8550  [SOT-23-3_L2.9-W1.4-P1.90-LS2.6-BR]  50.95 61.1 270 top
R0  1kΩ  [R0805]  51.57 44.82 90 top
R1  1kΩ  [R0805]  46.63 44.82 90 top
R2  1kΩ  [R0805]  41.69 44.82 90 top
R3  1kΩ  [R0805]  36.76 44.82 90 top
R4  1kΩ  [R0805]  31.82 44.82 90 top
R5  1kΩ  [R0805]  26.88 44.82 90 top
R6  1kΩ  [R0805]  21.94 44.82 90 top
R7  1kΩ  [R0805]  17 44.82 90 top
R8  1kΩ  [R0805]  12.06 44.82 90 top
R9  1kΩ  [R0805]  7.12 44.82 90 top
R10  4.7kΩ  [R0805]  11.2 67.57 180 top
R11  4.7kΩ  [R0805]  50.91 64.5 0 top
R12  4.7kΩ  [R0805]  57 64.48 0 top
R13  4.7kΩ  [R0805]  57 57.49 180 top
R14  4.7kΩ  [R0805]  50.91 57.7 180 top
R15  1kΩ  [R0805]  66.01 48.53 90 top
R16  1kΩ  [R0805]  83.92 48.53 90 top
R17  1kΩ  [R0805]  78.8 48.53 90 top
R18  1kΩ  [R0805]  73.68 48.53 90 top
R19  1kΩ  [R0805]  71.12 48.53 90 top
R20  1kΩ  [R0805]  68.57 48.53 90 top
R21  1kΩ  [R0805]  81.36 48.53 90 top
R22  1kΩ  [R0805]  76.24 48.53 90 top
R23  10kΩ  [R0805]  83.2 34.66 270 top
R24  10kΩ  [R0805]  73.19 34.58 270 top
R25  10kΩ  [R0805]  63.19 34.58 270 top
R26  10kΩ  [R0805]  53.18 34.58 270 top
R27  10kΩ  [R0805]  43.18 34.58 270 top
R28  10kΩ  [R0805]  33.17 34.58 270 top
R29  10kΩ  [R0805]  23.17 34.58 270 top
R30  10kΩ  [R0805]  13.17 34.58 270 top
R31  10kΩ  [R0805]  12.96 18.42 270 top
R32  10kΩ  [R0805]  23 18.42 270 top
R33  10kΩ  [R0805]  33.03 18.42 270 top
R34  10kΩ  [R0805]  43.06 18.42 270 top
R35  10kΩ  [R0805]  53.1 18.42 270 top
R36  10kΩ  [R0805]  63.13 18.42 270 top
R37  10kΩ  [R0805]  73.16 18.42 270 top
R38  10kΩ  [R0805]  83.2 18.42 270 top
R39  47kΩ  [R0805]  50.91 57.57 0 bottom
R40  47kΩ  [R0805]  57.02 57.57 0 bottom
R41  47kΩ  [R0805]  57.02 64.58 0 bottom
R42  47kΩ  [R0805]  50.91 64.58 0 bottom
SW0  SS12F44G4  [SW-TH_SHOU-HAN_SS12F44G4]  78.62 31.95 90 top
SW1  SS12F44G4  [SW-TH_SHOU-HAN_SS12F44G4]  68.45 31.95 90 top
SW2  SS12F44G4  [SW-TH_SHOU-HAN_SS12F44G4]  58.39 31.95 90 top
SW3  SS12F44G4  [SW-TH_SHOU-HAN_SS12F44G4]  48.34 31.95 90 top
SW4  SS12F44G4  [SW-TH_SHOU-HAN_SS12F44G4]  38.29 31.95 90 top
SW5  SS12F44G4  [SW-TH_SHOU-HAN_SS12F44G4]  28.24 31.95 90 top
SW6  SS12F44G4  [SW-TH_SHOU-HAN_SS12F44G4]  18.19 31.95 90 top
SW7  SS12F44G4  [SW-TH_SHOU-HAN_SS12F44G4]  8.14 31.95 90 top
SW8  SS12F44G4  [SW-TH_SHOU-HAN_SS12F44G4]  8.14 15.7 90 top
SW9  SS12F44G4  [SW-TH_SHOU-HAN_SS12F44G4]  18.19 15.7 90 top
SW10  SS12F44G4  [SW-TH_SHOU-HAN_SS12F44G4]  28.24 15.7 90 top
SW11  SS12F44G4  [SW-TH_SHOU-HAN_SS12F44G4]  38.29 15.7 90 top
SW12  SS12F44G4  [SW-TH_SHOU-HAN_SS12F44G4]  48.34 15.7 90 top
SW13  SS12F44G4  [SW-TH_SHOU-HAN_SS12F44G4]  58.39 15.7 90 top
SW14  SS12F44G4  [SW-TH_SHOU-HAN_SS12F44G4]  68.45 15.7 90 top
SW15  SS12F44G4  [SW-TH_SHOU-HAN_SS12F44G4]  78.5 15.7 90 top
SW16  MK-12C02-G015  [SW-SMD_G-SWITCH_MK-12C02-G015]  3.39 64.41 90 bottom
U3  AMS1117-3.3  [SOT-223-3_L6.5-W3.4-P2.30-LS7.0-BR]  13.53 60.52 90 top

## Footprints (pads in the part's own frame, mm; a bottom-side part is the same pattern mirrored in y, then rotated)
C0603
  rect 0.8x0.9 smd: 1(-0.7,0) 2(0.7,0)
C0805
  rect 1.41x1.35 smd: 1(-1,0) 2(1,0)
CASE-B_3528
  rect 1.506x2.376 smd: 1(-1.861,0) 2(1.861,0)
HDR-TH_2P-P2.54-V-M
  rect 2x2 hole 1.2: 1(-1.27,0)
  round 2 hole 1.2: 2(1.27,0)
HDR-TH_10P-P2.54-V-M-1
  rect 1.575x1.7 hole 1.1: 1(-11.43,0)
  round 1.7 hole 1.1: 2(-8.89,0) 3(-6.35,0) 4(-3.81,0) 5(-1.27,0) 6(1.27,0) 7(3.81,0) 8(6.35,0) 9(8.89,0) 10(11.43,0)
Jumper:SolderJumper-3_P1.3mm_Open_RoundedPad1.0x1.5mm
  custom 1.05x1.5 smd: 1(-1.3,0) 3(1.3,0)
  rect 1x1.5 smd: 2(0,0)
LED0805-R-RD
  rect 1x1.399 smd: 1(1.05,0) 2(-1.05,0)
LED-SEG-TH_12P-L30.0-W14.0-P2.54-S10.26-BL
  round 1.6 hole 1: 1(-6.35,-5.13) 2(-3.81,-5.13) 3(-1.27,-5.13) 4(1.27,-5.13) 5(3.81,-5.13) 6(6.35,-5.13) 7(6.35,5.13) 8(3.81,5.13) 9(1.27,5.13) 10(-1.27,5.13) 11(-3.81,5.13) 12(-6.35,5.13)
Pad_e130
  round 5 hole 3.2: 1(0,0)
Pad_e132
  round 5 hole 3.2: 1(0,0)
Pad_e133
  round 5 hole 3.2: 2(0,0)
Pad_e134
  round 5 hole 3.2: 3(0,0)
R0805
  rect 1.133x1.377 smd: 1(-1,0) 2(1,0)
SOT-23-3_L2.9-W1.4-P1.90-LS2.6-BR
  rect 0.91x0.6 smd: 1(1.055,-0.955) 2(1.055,0.955) 3(-1.055,0)
SOT-223-3_L6.5-W3.4-P2.30-LS7.0-BR
  rect 2.5x1.1 smd: 1(2.97,-2.3) 2(2.97,0) 3(2.97,2.3)
  rect 2.34x3.6 smd: 4(-2.97,0)
SW-SMD_4P-L6.0-W6.0-P4.50-LS9.5
  rect 2.55x1.2 smd: 1(-4.075,2.25) 2(4.075,2.25) 3(-4.075,-2.25) 4(4.075,-2.25)
SW-SMD_G-SWITCH_MK-12C02-G015
  rect 0.9x2 smd: 1(-2.25,1.49) 2(0.75,1.49) 3(2.25,1.49)
  rect 1.1x0.93 smd: 4(3.8,0.779) 5(3.8,-1.49) 6(-3.8,-1.49) 7(-3.8,0.779)
SW-TH_SHOU-HAN_SS12F44G4
  round 1.6 hole 1: 1(-3,0) 2(0,0) 3(3,0)
  oval 1.3x2.3 hole 0.7x1.8: 4(5.85,0) 5(-5.85,0)

## Nets
As in the schematic.

Pads without a net: KEY0 2 3; KEY1 2 3; KEY2 2 3; KEY3 2 3; NOREF 2; NOREF#2 1; NOREF#3 3; NOREF#4 1; SW0 4 5; SW1 4 5; SW2 4 5; SW3 4 5; SW4 4 5; SW5 4 5; SW6 4 5; SW7 4 5; SW8 4 5; SW9 4 5; SW10 4 5; SW11 4 5; SW12 4 5; SW13 4 5; SW14 4 5; SW15 4 5; SW16 1 4 5 6 7

## Via types
v1: diameter 0.61, hole 0.305, Top Layer to Bottom Layer, 41 vias

## Routing (per net, layer and track width the routed paths; a pad name or vN(x,y) marks a point on that pad's centre or on a via; arc(x,y) is an arc through that point)
3.3V: length 6
  Top Layer w0.5: v1(55.72,69.35) 56.72,69.35 Q2.3 ; Q3.3 56.77,62.3 v1(55.14,62.3) ; Q1.3 50.61,69.3 v1(49.71,69.3) ; v1(50.98,62.33) v1(49.75,62.33)
3.3V_F: length 5.8
  Bottom Layer w1.05: 12.74,69.2 12.74,72.57 11.86,73.45 11.86,74.38 12,74.52 12,74.55 11.97,74.57
3.3V_R: length 6.1
  Top Layer w0.5: 13.59,63.93 13.54,63.98 13.54,64.77 12.62,65.69 10.87,65.69 10.17,66.39 10.17,67.47 10.27,67.57
  vias: v1(12.3,60.43) v1(12.3,59.37) v1(13.32,60.4) v1(13.32,59.4) v1(14.27,60.42) v1(14.3,59.4) v1(15.24,60.4) v1(15.27,59.4) v1(16.22,60.39) v1(16.24,59.4)
+5V: length 19.4
  Top Layer w0.9: U3.3 8.53,63.49 7.77,64.25 7.77,69.79 9.33,71.35 13.27,71.35 14.46,72.54 H2.1
A: length 20.1
  Top Layer w0.201: R15.2 66.01,62.24 LED11.11
B: length 19
  Top Layer w0.201: R16.2 83.92,64.9 LED11.7
C: length 8.7
  Top Layer w0.201: LED11.4 78.8,54.68 R17.2
D: length 8.7
  Top Layer w0.201: LED11.2 73.68,54.72 R18.2
D1: length 14.8
  Top Layer w0.201: H3.3 46.01,76.17 46.01,68.41 R11.1
D2: length 15.3
  Top Layer w0.201: H3.5 51.31,75.94 51.31,73.48 54.28,70.51 54.28,66.2 R12.1
D3: length 23.3
  Top Layer w0.201: H3.4 48.68,76.03 48.68,73.76 53.34,69.1 53.34,60.14 R13.2
D4: length 22.7
  Top Layer w0.201: R14.2 43.64,63.98 43.64,75.99 H3.2
DIGI4: length 5.6
  Top Layer w0.201: v1(53.15,57.65) 51.97,57.65 R14.1 51.91,58.13 Q4.1
  Bottom Layer w0.201: v1(53.15,57.65) 53.14,57.66 51.91,57.66
DP: length 8.7
  Top Layer w0.201: LED11.3 76.24,54.7 R22.2
E: length 8.7
  Top Layer w0.201: LED11.1 71.12,54.73 R19.2
F: length 21.3
  Top Layer w0.201: R20.2 68.57,53.28 67.02,54.82 67.02,60.71 LED11.10
G: length 8.7
  Top Layer w0.201: R21.2 81.36,54.66 LED11.5
LED0: length 45.2
  Top Layer w0.201: H3.1 41.03,76.06 41.03,73.52 32.26,64.75 32.26,58.44 36.35,54.35 48.5,54.35 LED0.1
LED1: length 40.9
  Top Layer w0.201: LED1.1 44.15,53.75 35.31,53.75 31.53,57.53 31.53,66.43 38.62,73.52 38.62,75.97 H1.10
LED2: length 36.5
  Top Layer w0.201: H1.9 36.08,75.97 36.08,73.4 30.8,68.11 30.8,56.57 34.21,53.16 39.8,53.16 LED2.1
LED3: length 32.1
  Top Layer w0.201: H1.8 33.54,75.97 33.54,73.65 30.06,70.17 30.06,55.65 33.14,52.57 35.46,52.57 LED3.1
LED4: length 28.3
  Top Layer w0.201: H1.7 29.7,77.14 31.05,75.79 31.05,73.58 29.33,71.85 29.33,54.4 31.82,51.91 LED4.1
LED5: length 27.3
  Top Layer w0.201: LED5.1 26.88,52.75 28.59,54.46 28.59,75.83 H1.6
LED6: length 31.2
  Top Layer w0.201: LED6.1 22.91,52.24 24.46,52.24 27.84,55.62 27.84,72.43 25.77,74.5 25.77,77.07 25.57,77.27 H1.5
LED7: length 35.1
  Top Layer w0.201: LED7.1 18.72,52.99 23.55,52.99 27.13,56.57 27.13,69.9 23.38,73.65 23.38,75.97 H1.4
LED8: length 39.5
  Top Layer w0.201: LED8.1 12.17,51.27 14.57,53.67 22.54,53.67 26.39,57.52 26.39,67.97 20.84,73.52 20.84,75.97 H1.3
LED9: length 43.9
  Top Layer w0.201: H1.2 18.3,75.97 18.3,73.65 25.66,66.29 25.66,58.45 21.56,54.35 10.2,54.35 LED9.1
SEG_A: length 76.2
  Top Layer w0.201: R15.1 66.01,46.76 65.25,46 64.31,46 63.29,47.02 v1(63.29,48.48)
  Bottom Layer w0.201: v1(63.29,48.48) 63.29,49.25 66.04,52 82.95,52 87.44,56.49 87.44,68.39 83.8,72.03 64.16,72.03 64.05,72.14 64.05,75.9 H3.10
SEG_B: length 64.3
  Top Layer w0.201: H3.6 53.84,75.95 53.84,73.67 57.03,70.48 83.15,70.48 87.63,66 87.63,48.55 85.4,46.32 84.12,46.32 83.92,46.53 R16.1
SEG_C: length 66.4
  Top Layer w0.201: R17.1 78.8,46.14 79.62,45.32 85.87,45.32 88.67,48.12 88.67,66.57 83.59,71.65 59.54,71.65 57.6,73.59 H4.8
SEG_D: length 72.8
  Top Layer w0.201: H4.9 60.14,73.57 60.98,72.73 84.11,72.73 89.83,67.01 89.83,47.8 86.27,44.24 75.38,44.24 73.68,45.94 R18.1
SEG_DP: length 72.6
  Top Layer w0.201: R22.1 76.24,45.92 77.39,44.77 86.06,44.77 89.23,47.94 89.23,66.8 83.83,72.2 60.3,72.2 58.93,73.57 58.93,75.94 H3.8
SEG_E: length 84.9
  Top Layer w0.201: v1(60.38,48.48) 60.38,47.04 62.35,45.07 69.63,45.07 71.12,46.56 R19.1
  Bottom Layer w0.201: H3.9 61.32,76.09 61.32,71.01 63.03,69.3 82.67,69.3 84.71,67.26 84.71,57.62 81.82,54.73 65.22,54.73 60.38,49.89 v1(60.38,48.48)
SEG_F: length 77.6
  Top Layer w0.201: 61.78,48.45 61.87,48.36 61.87,47.12 63.48,45.51 67.64,45.51 68.57,46.44 R20.1
  Bottom Layer w0.201: v1(61.87,48.48) 61.87,49.61 65.63,53.37 82.39,53.37 86.07,57.06 86.07,67.83 83.24,70.66 63.6,70.66 62.68,71.57 H4.10
SEG_G: length 66.1
  Top Layer w0.201: H3.7 56.42,75.91 56.42,73.51 58.84,71.09 83.35,71.09 88.15,66.29 88.15,48.32 85.63,45.8 82.18,45.8 81.36,46.62 R21.1
SW0: length 122.9
  Top Layer w0.201: 96.66,9.22 90.26,15.62 86.96,15.62 85.12,17.46 85.12,34.51 83.97,35.66 R23.1 83.2,37.03 v1(83.18,37.04)
  Bottom Layer w0.201: v1(83.18,37.04) 77.75,42.47 35.98,42.47 30.17,48.28 30.17,62.87 37.32,70.02 H2.10
SW1: length 118.1
  Top Layer w0.201: R24.1 73.26,35.64 ; 73.26,35.64 v1(73.26,37.09) ; 73.26,35.64 76.7,39.09 83.06,39.09 85.57,36.58 85.57,27.37 87.54,25.4 90.19,25.4 96.66,18.92
  Bottom Layer w0.201: v1(73.26,37.09) 68.57,41.78 35.14,41.78 29.07,47.85 29.07,64.76 34.78,70.47 H2.9
SW2: length 109.9
  Top Layer w0.201: v1(63.2,37.12) 63.19,37.11 R25.1 67.17,39.56 83.41,39.56 88.22,34.75 90.36,34.75 96.48,28.63 96.66,28.63
  Bottom Layer w0.201: v1(63.2,37.12) 59.22,41.1 34.2,41.1 27.96,47.34 27.96,66.66 32.24,70.93 H2.8
SW3: length 107
  Top Layer w0.201: v1(53.29,37.35) 53.29,36.09 53.34,36.04 ; 53.34,36.04 53.43,36.04 57.41,40.02 92.02,40.02 93.71,38.33 96.66,38.33 ; 53.34,36.04 53.27,35.97 53.27,35.58
  Bottom Layer w0.201: v1(53.29,37.35) 50.16,40.48 33.24,40.48 26.86,46.86 26.86,68.55 29.7,71.39 H2.7
SW4: length 51.8
  Top Layer w0.201: 43.1,35.73 43.2,35.82 43.2,37.34 v1(43.18,37.35)
  Bottom Layer w0.201: v1(43.18,37.35) 40.77,39.76 32.38,39.76 25.76,46.38 25.76,70.44 27.16,71.84 H2.6
SW5: length 42.8
  Top Layer w0.201: v1(33.22,37.38) 33.22,35.84 33.04,35.66
  Bottom Layer w0.201: v1(33.22,37.38) 24.65,45.94 24.65,74.76 H2.5
SW6: length 39.9
  Top Layer w0.201: 23.52,35.69 23.28,35.94 v1(23.28,37.36)
  Bottom Layer w0.201: 23.33,37.36 23.55,37.59 23.55,69.47 22.08,70.95 H2.4
SW7: length 44.6
  Top Layer w0.201: 12.78,35.85 12.91,35.85 13.09,35.67 13.2,35.78 v1(13.2,37.36)
  Bottom Layer w0.201: v1(13.2,37.36) 22.45,46.61 22.45,67.58 19.54,70.49 H2.3
SW8: length 62.2
  Top Layer w0.201: R31.1 12.96,21.1 v1(12.92,21.14)
  Bottom Layer w0.201: H2.2 17,70.02 21.3,65.71 21.3,47.61 11.06,37.37 11.06,23 v1(12.92,21.14)
SW9: length 150.2
  Top Layer w0.201: R32.1 23,21.03 v1(22.96,21.07)
  Bottom Layer w0.201: v1(22.96,21.07) 26.9,25.01 83.76,25.01 84.99,26.24 84.99,37.38 79.19,43.18 49.94,43.18 44.33,48.79 44.33,69.1 39.82,73.61 H4.1
SW10: length 140.2
  Top Layer w0.201: v1(33.01,21.09) 33.03,21.07 R33.1
  Bottom Layer w0.201: 36.27,24.52 84.24,24.52 85.68,25.96 85.68,37.66 79.47,43.86 50.22,43.86 45.01,49.07 45.01,70.86 42.36,73.51 H4.2 ; v1(33.01,21.09) 36.27,24.35
SW11: length 130.3
  Top Layer w0.201: v1(43.05,21.09) 43.06,21.08 R34.1
  Bottom Layer w0.201: v1(43.05,21.09) 45.93,23.97 ; H4.3 44.9,72.32 45.7,71.52 45.7,49.36 50.51,44.55 79.76,44.55 86.36,37.94 86.36,25.68 84.72,24.03 45.93,24.03
SW12: length 121.3
  Top Layer w0.201: R35.1 v1(53.1,21.07)
  Bottom Layer w0.201: 55.38,23.55 85.2,23.55 87.04,25.39 87.04,38.23 80.04,45.23 50.79,45.23 46.38,49.64 46.38,71.39 47.44,72.45 H4.4 ; v1(53.1,21.07) 53.1,21.24 55.38,23.52
SW13: length 112.7
  Top Layer w0.201: R36.1 v1(63.13,21.02)
  Bottom Layer w0.201: v1(63.13,21.02) 65.07,22.96 ; H4.5 49.98,73.21 47.07,70.3 47.07,49.92 51.07,45.92 80.32,45.92 87.73,38.51 87.73,25.11 85.68,23.06 65.07,23.06
SW14: length 104.4
  Top Layer w0.201: R37.1 73.16,21.09 v1(73.19,21.12)
  Bottom Layer w0.201: v1(73.19,21.12) 74.64,22.57 86.16,22.57 88.41,24.83 88.41,38.79 80.61,46.6 51.36,46.6 47.75,50.21 47.75,68.84 52.52,73.61 H4.6
SW15: length 96
  Top Layer w0.201: R38.1 83.2,21.07 v1(83.19,21.08)
  Bottom Layer w0.201: v1(83.19,21.08) 84.03,21.92 86.47,21.92 89.1,24.54 89.1,39.08 80.89,47.28 51.64,47.28 48.43,50.49 48.43,66.88 55.06,73.51 H4.7
$2N1941: length 2.6
  Top Layer w0.5: R10.1 14.69,67.57 LED10.1
$2N2644: length 37.3
  Top Layer w0.201: Q4.2 51.64,60.31 v1(51.64,61.11)
  Bottom Layer w0.201: v1(51.64,61.11) 53.74,59.01 58.4,59.01 64.1,64.71 73.85,64.71 LED11.6
$2N2657: length 6.8
  Top Layer w0.201: R11.2 51.91,64.93 Q1.1 50.9,66.85 v1(50.95,66.8)
  Bottom Layer w0.201: 50.99,66.8 51.05,66.86 ; 50.99,66.8 v1(50.95,66.8) ; 50.99,66.8 50.94,66.75 51.91,65.78 51.91,64.65
$2N2658: length 7.9
  Top Layer w0.201: v1(55.36,66.18) 55.36,66.21 Q2.1 58,65.01 R12.2
  Bottom Layer w0.201: 57.98,64.5 57.98,65.03 56.83,66.18 v1(55.36,66.18)
$2N2659: length 6.1
  Top Layer w0.201: Q3.1 58,58.01 R13.1 58.02,57.47 v1(59.44,57.47)
  Bottom Layer w0.201: v1(59.44,57.47) 59.43,57.48 58.05,57.48
$2N2685: length 25.2
  Top Layer w0.201: v1(58.03,61.07) 57.99,61.03 Q3.2
  Bottom Layer w0.201: LED11.8 77.33,65.94 61.89,65.94 58.03,62.08 v1(58.03,61.07)
$2N2688: length 19.6
  Top Layer w0.201: LED11.9 75.03,68.71 59.97,68.71 58.19,66.92 Q2.2
$2N2689: length 18.8
  Top Layer w0.201: Q1.2 51.42,67.33 v1(51.42,67.97)
  Bottom Layer w0.201: v1(51.42,67.97) 51.95,67.44 LED11.12
$2N3631: length 3.4
  Top Layer w0.201: LED0.2 R0.2
$2N3633: length 3.4
  Top Layer w0.201: LED1.2 R1.2
$2N3635: length 3.3
  Top Layer w0.201: LED2.2 R2.2
$2N3638: length 3.3
  Top Layer w0.201: LED4.2 31.82,45.82
$2N3640: length 3.3
  Top Layer w0.201: LED3.2 R3.2
$2N3642: length 3.3
  Top Layer w0.201: LED5.2 26.88,45.82
$2N3644: length 3.3
  Top Layer w0.201: LED6.2 21.94,45.82
$2N3646: length 3.4
  Top Layer w0.201: R7.2 17,45.82 LED7.2
$2N3648: length 3.4
  Top Layer w0.201: LED8.2 12.06,45.82 R8.2
$2N3652: length 3.4
  Top Layer w0.201: LED9.2 7.12,45.82 R9.2
$2N6552: length 11.4
  Bottom Layer w0.9: SW16.3 6.1,66.66 7.11,67.67 7.11,69.81 8.56,71.26 10.71,71.26 11.45,70.52 JP1.2
$2N13851: length 5.7
  Top Layer w0.5: SW7.2 11.54,31.95 R30.2
$2N13869: length 5.7
  Top Layer w0.5: R29.2 21.54,31.95 SW6.2
$2N13870: length 5.6
  Top Layer w0.5: R28.2 31.55,31.95 SW5.2
$2N13871: length 5.6
  Top Layer w0.5: R27.2 41.55,31.95 SW4.2
$2N13872: length 5.5
  Top Layer w0.5: R26.2 51.55,31.95 SW3.2
$2N13873: length 5.5
  Top Layer w0.5: SW2.2 61.56,31.95 R25.2
$2N13874: length 5.4
  Top Layer w0.5: SW1.2 71.56,31.95 R24.2
$2N13876: length 5.4
  Top Layer w0.5: R38.2 81.47,15.7 SW15.2
$2N13894: length 5.4
  Top Layer w0.5: SW14.2 71.44,15.7 R37.2
$2N13895: length 5.4
  Top Layer w0.5: SW13.2 61.41,15.7 R36.2
$2N13896: length 6
  Top Layer w0.5: R35.2 53.1,16.46 52.33,15.7 SW12.2
$2N13897: length 5.5
  Top Layer w0.5: R34.2 41.34,15.7 SW11.2
$2N13898: length 5.5
  Top Layer w0.5: R33.2 31.31,15.7 SW10.2
$2N13899: length 5.5
  Top Layer w0.5: R32.2 21.27,15.7 SW9.2
$2N13900: length 5.5
  Top Layer w0.5: R31.2 11.24,15.7 SW8.2
$2N13901: length 5.3
  Top Layer w0.5: SW0.2 81.48,31.95 R23.2

## Copper pours and planes (outline as drawn; the poured copper is in the pictures)
3.3V on Bottom Layer: 1.01,75 1.03,75.35 1.08,75.74 1.17,76.13 1.31,76.51 1.47,76.87 1.68,77.21 1.91,77.53 2.18,77.83 2.48,78.1 2.8,78.33 3.14,78.54 3.5,78.7 3.88,78.84 4.27,78.93 4.66,78.98 5.01,79 95.01,79 95.36,78.98 95.75,78.93 96.14,78.84 96.52,78.7 96.88,78.54 97.22,78.33 97.54,78.1 97.84,77.83 98.11,77.53 98.34,77.21 98.55,76.87 98.71,76.51 98.85,76.13 98.94,75.74 98.99,75.35 99.01,75 99.01,5 98.99,4.65 98.94,4.26 98.85,3.87 98.71,3.49 98.55,3.13 98.34,2.79 98.11,2.47 97.84,2.17 97.54,1.9 97.22,1.67 96.88,1.46 96.52,1.3 96.14,1.16 95.75,1.07 95.36,1.02 95.01,1 5.01,1 4.66,1.02 4.27,1.07 3.88,1.16 3.5,1.3 3.14,1.46 2.8,1.67 2.48,1.9 2.18,2.17 1.91,2.47 1.68,2.79 1.47,3.13 1.31,3.49 1.17,3.87 1.08,4.26 1.03,4.65 1.01,5
3.3V_R on Top Layer: 11.74,64.14 22.75,64.14 22.75,57.84 11.74,57.84
3.3V_R on Bottom Layer: 9.67,69.87 10.69,69.87 10.69,58.98 9.67,58.98
3.3V_R on Bottom Layer: 9.66,61.05 16.85,61.05 16.85,58.92 9.66,58.92
+5V on Top Layer: 7.32,64.07 11.71,64.07 11.71,62.97 7.32,62.97
+5V on Top Layer: 7.32,63.96 8.73,63.96 8.73,61.06 7.32,61.06
GND on Top Layer: 1.01,76 1.02,76.26 1.07,76.61 1.16,76.94 1.29,77.27 1.46,77.57 1.66,77.86 1.89,78.12 2.15,78.35 2.44,78.55 2.74,78.72 3.07,78.85 3.4,78.94 3.75,78.99 4.01,79 96.01,79 96.27,78.99 96.62,78.94 96.95,78.85 97.28,78.72 97.58,78.55 97.87,78.35 98.13,78.12 98.36,77.86 98.56,77.57 98.73,77.27 98.86,76.94 98.95,76.61 99,76.26 99.01,76 99.01,4 99,3.74 98.95,3.39 98.86,3.06 98.73,2.73 98.56,2.43 98.36,2.14 98.13,1.88 97.87,1.65 97.58,1.45 97.28,1.28 96.95,1.15 96.62,1.06 96.27,1.01 96.01,1 4.01,1 3.75,1.01 3.4,1.06 3.07,1.15 2.74,1.28 2.44,1.45 2.15,1.65 1.89,1.88 1.66,2.14 1.46,2.43 1.29,2.73 1.16,3.06 1.07,3.39 1.02,3.74 1.01,4

Small or netless copper shapes (teardrops, artwork), in the pictures only: 128 on Top Layer, 40 on Bottom Layer

## Text on the board
Bottom Silkscreen Layer: 5v | 3.3v | on | off
Top Silkscreen Layer: B7 | A7 | B6 | A6 | B5 | A5 | B4 | A4 | A3 | B3 | A2 | B2 | A1 | B1 | B0 | A0 | 5 | 4 | 2 | 1 | 6 | 3 | 0 | 9 | 8 | 7 | off | on | FPGA LAB | GND | 3.3V | 5V | S8 | L9 | S7 | L8 | S6 | L7 | S5 | L6 | S4 | L5 | L4 | S3 | L3 | S2 | L2 | S1 | S0 | L1 | S9 | L0 | D4 | S10 | S11 | D1 | D3 | S12 | D2 | S13 | S14 | B | S15 | G | DP | C | D | E | A | F
